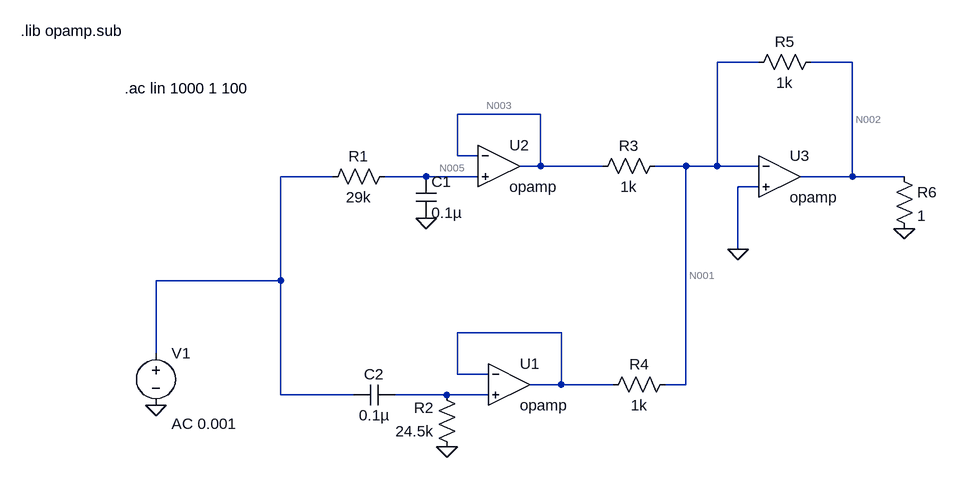
[diagram p0: schematic 2ndOrderBSF.asc]
2ndOrderBSF.asc, the LTspice schematic file:
Version 4
SHEET 1 1192 680
WIRE 912 -288 848 -288
WIRE 1056 -288 992 -288
WIRE 576 -208 448 -208
WIRE 448 -144 448 -208
WIRE 480 -144 448 -144
WIRE 576 -128 576 -208
WIRE 576 -128 544 -128
WIRE 672 -128 576 -128
WIRE 800 -128 752 -128
WIRE 848 -128 848 -288
WIRE 848 -128 800 -128
WIRE 912 -128 848 -128
WIRE 256 -112 176 -112
WIRE 400 -112 336 -112
WIRE 480 -112 400 -112
WIRE 1056 -112 1056 -288
WIRE 1056 -112 976 -112
WIRE 1136 -112 1056 -112
WIRE 912 -96 880 -96
WIRE 880 0 880 -96
WIRE 176 48 176 -112
WIRE 176 48 -16 48
WIRE 608 128 448 128
WIRE -16 160 -16 48
WIRE 448 192 448 128
WIRE 496 192 448 192
WIRE 608 208 608 128
WIRE 608 208 560 208
WIRE 688 208 608 208
WIRE 800 208 800 -128
WIRE 800 208 768 208
WIRE 176 224 176 48
WIRE 288 224 176 224
WIRE 432 224 352 224
WIRE 496 224 432 224
FLAG -16 240 0
FLAG 1136 -32 0
FLAG 880 0 0
FLAG 432 304 0
FLAG 400 -48 0
SYMBOL voltage -16 144 R0
WINDOW 123 24 124 Left 2
WINDOW 39 0 0 Left 0
SYMATTR InstName V1
SYMATTR Value ""
SYMATTR Value2 AC 0.001
SYMBOL res 352 -128 R90
WINDOW 0 0 56 VBottom 2
WINDOW 3 32 56 VTop 2
SYMATTR InstName R1
SYMATTR Value 29k
SYMBOL res 448 320 R180
WINDOW 0 36 76 Left 2
WINDOW 3 36 40 Left 2
SYMATTR InstName R2
SYMATTR Value 24.5k
SYMBOL OpAmps\\opamp 528 144 R0
SYMATTR InstName U1
SYMBOL OpAmps\\opamp 512 -192 R0
SYMATTR InstName U2
SYMBOL res 768 -144 R90
WINDOW 0 0 56 VBottom 2
WINDOW 3 32 56 VTop 2
SYMATTR InstName R3
SYMATTR Value 1k
SYMBOL res 784 192 R90
WINDOW 0 0 56 VBottom 2
WINDOW 3 32 56 VTop 2
SYMATTR InstName R4
SYMATTR Value 1k
SYMBOL OpAmps\\opamp 944 -176 R0
SYMATTR InstName U3
SYMBOL res 1008 -304 R90
WINDOW 0 0 56 VBottom 2
WINDOW 3 32 56 VTop 2
SYMATTR InstName R5
SYMATTR Value 1k
SYMBOL res 1120 -128 R0
SYMATTR InstName R6
SYMATTR Value 1
SYMBOL cap 384 -112 R0
SYMATTR InstName C1
SYMATTR Value 0.1µ
SYMBOL cap 352 208 R90
WINDOW 0 0 32 VBottom 2
WINDOW 3 32 32 VTop 2
SYMATTR InstName C2
SYMATTR Value 0.1µ
TEXT -224 -336 Left 2 !.lib opamp.sub
TEXT -64 -248 Left 2 !.ac lin 1000 1 100

The netlist it stands for:
* 2ndOrderBSF.asc
V1 N004 0 AC 0.001
R1 N005 N004 29k
R2 0 N007 24.5k
XU1 N006 N007 N006 opamp Aol=100K GBW=10Meg  ; pins invin noninvin out
XU2 N003 N005 N003 opamp Aol=100K GBW=10Meg  ; pins invin noninvin out
R3 N001 N003 1k
R4 N001 N006 1k
XU3 N001 0 N002 opamp Aol=100K GBW=10Meg  ; pins invin noninvin out
R5 N002 N001 1k
R6 N002 0 1
C1 N005 0 0.1µ
C2 N007 N004 0.1µ
.lib opamp.sub
.ac lin 1000 1 100
.backanno
.end

* Results of the author's LTspice run, read from the files saved beside the schematic
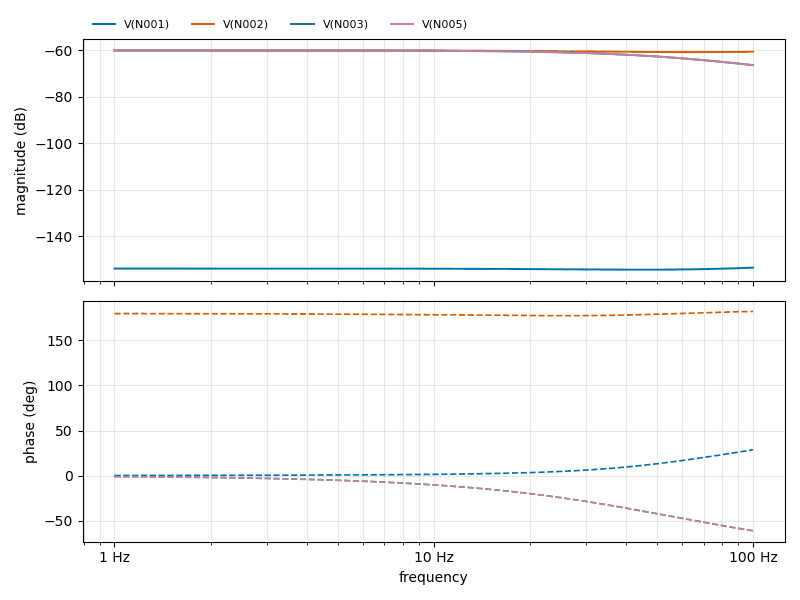
[diagram p1: AC Analysis of 2ndOrderBSF.asc, plotted from the saved traces]
* AC Analysis, 1 run:
*   V(N001): -153.98 dB at 1 Hz, -153.59 dB at 100 Hz, peak -153.59 dB at 100 Hz
*   V(N002): -60.00 dB at 1 Hz, -60.58 dB at 100 Hz, peak -60.00 dB at 1 Hz
*   V(N003): -60.00 dB at 1 Hz, -66.36 dB at 100 Hz, peak -60.00 dB at 1 Hz, 3 dB below the peak at 54.9 Hz
*   V(N005): -60.00 dB at 1 Hz, -66.35 dB at 100 Hz, peak -60.00 dB at 1 Hz, 3 dB below the peak at 54.9 Hz